# Altium project Xtern Ripper Boost-GaN.PrjPcb
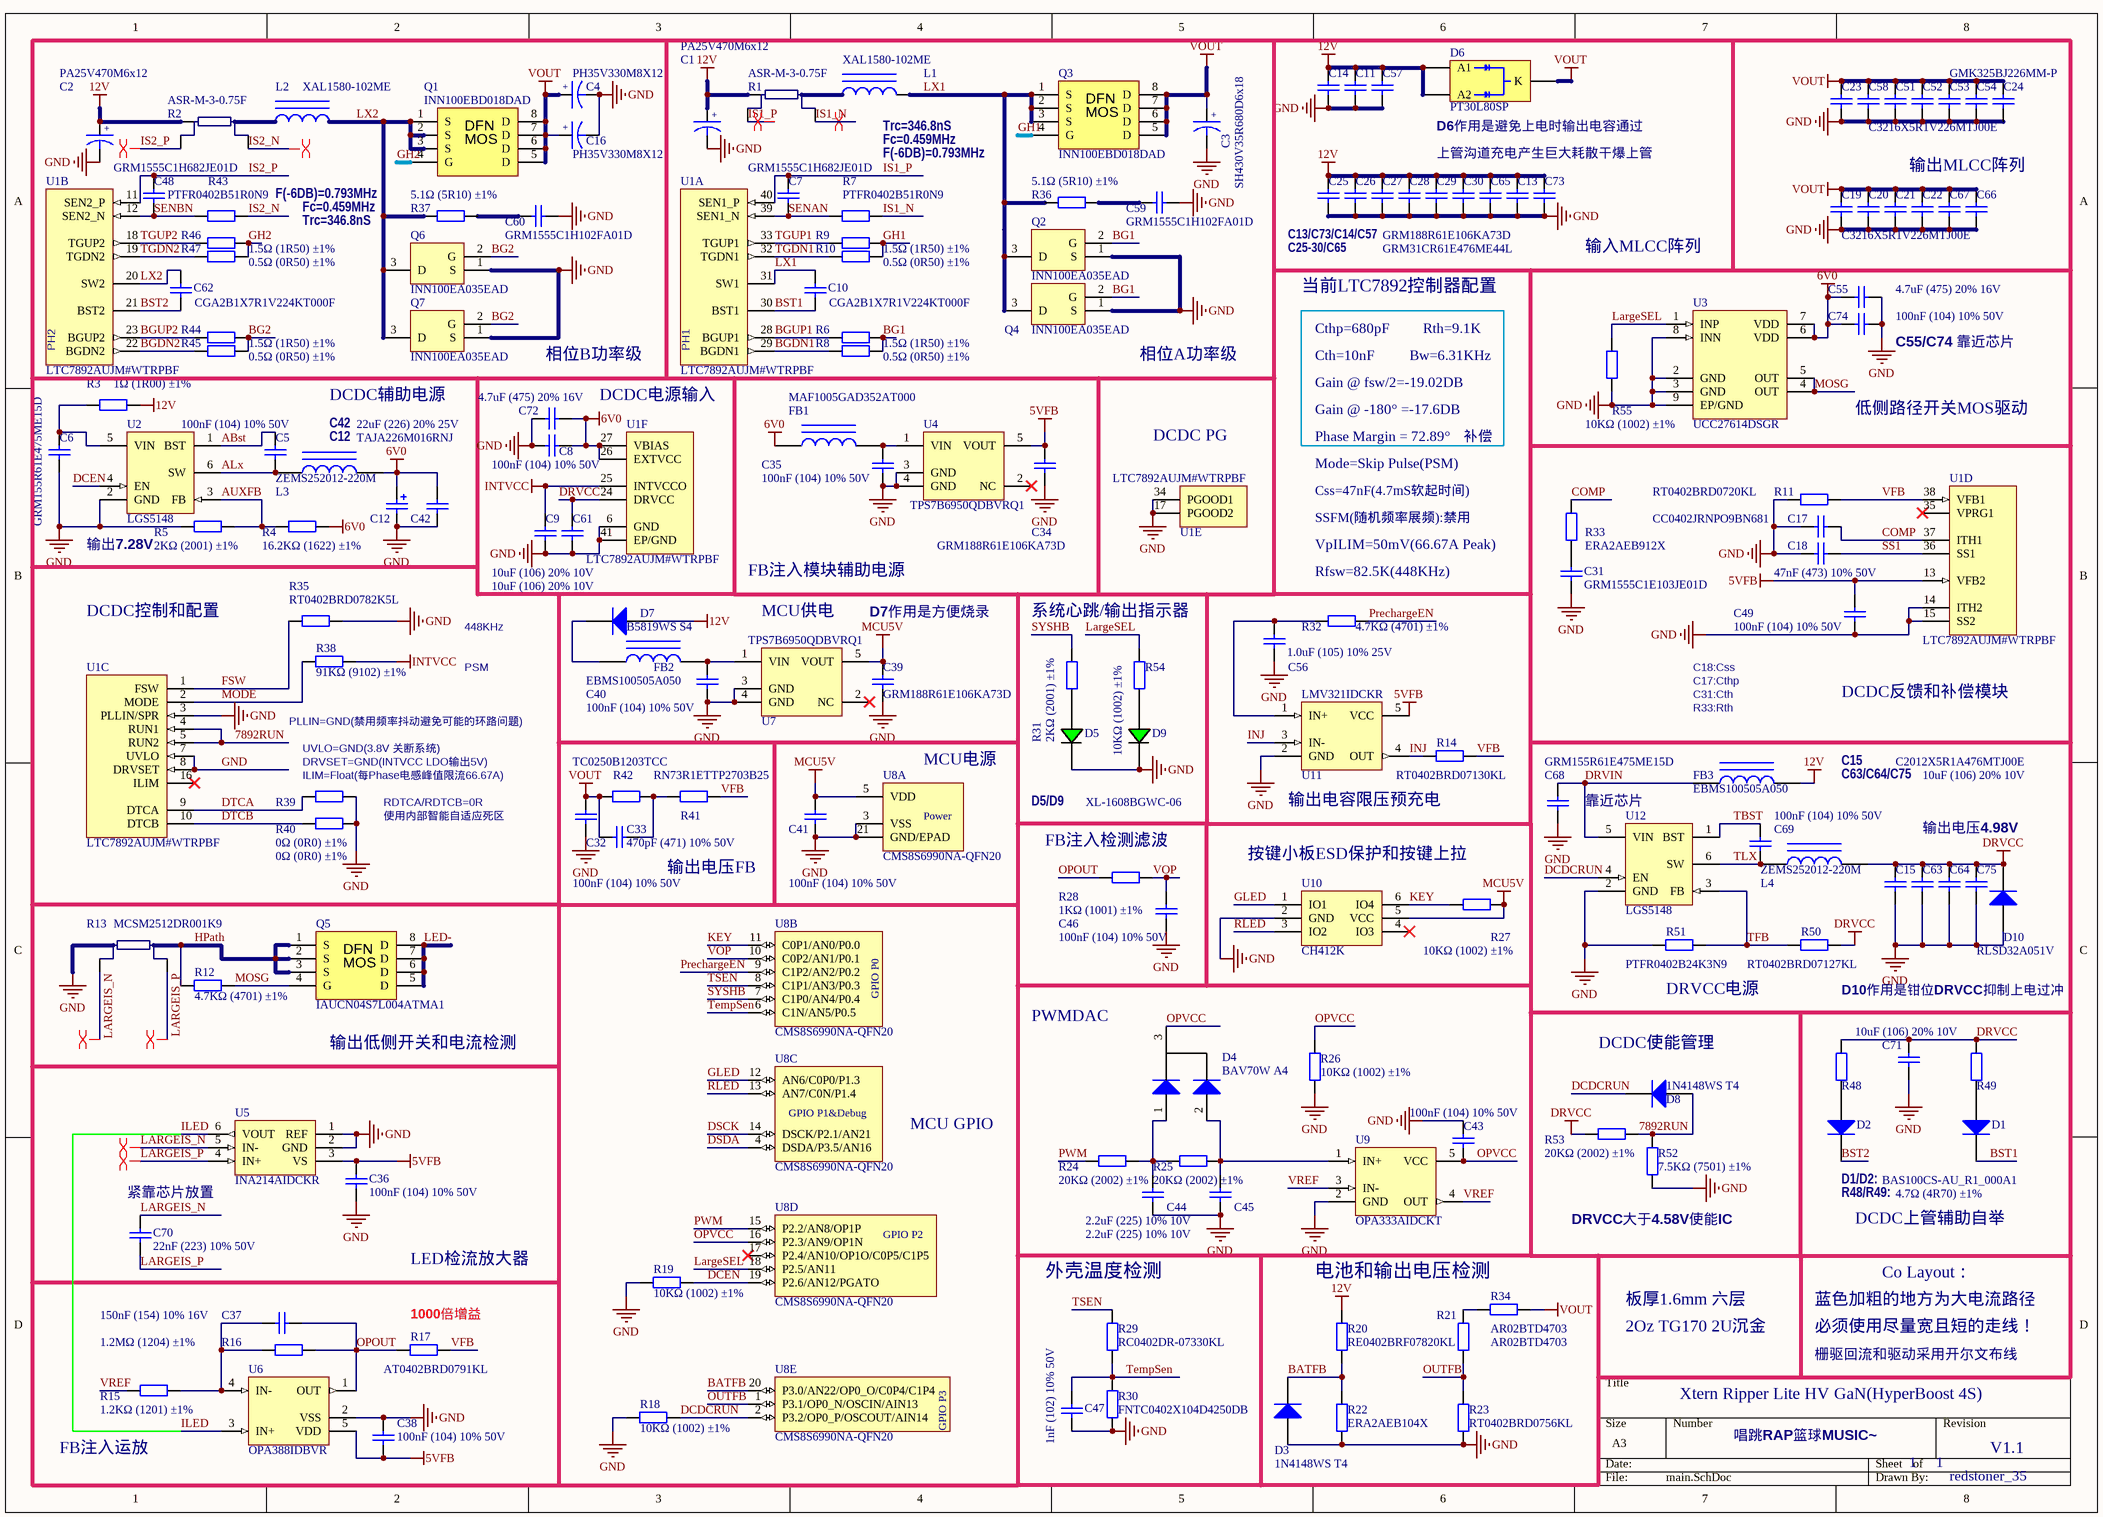
[diagram p0: main.SchDoc]
1 sheet, 165 parts. Net scope: global (net labels, ports and power ports of the same name join across sheets).
Board file: PCB2.PcbDoc

## Sheet main.SchDoc
size A3

### Parts
C1  PA25V470M6x12  [ElecCap_Hori]
C2  PA25V470M6x12  [ElecCap_Hori]
C3  SH430V35R680D6x18  [ElecCap_Hori]
C4  PH35V330M8X12  [CAP-8/3.5]
C5  100nF (104) 10% 50V  [0402_C]
C6  GRM155R61E475ME15D  [0402_C]
C7  GRM1555C1H682JE01D  [0402_C]
C8  100nF (104) 10% 50V  [0402_C]
C9  10uF (106) 20% 10V  [0402_C]
C10  CGA2B1X7R1V224KT000F  [0402_C]
C11  GRM188R61E106KA73D  [0603_C]  (value not drawn)
C12  TAJA226M016RNJ  [CASE-A_3216]
C13  GRM188R61E106KA73D  [0603_C]  (value not drawn)
C14  GRM188R61E106KA73D  [0603_C]
C15  C2012X5R1A476MTJ00E  [0805_C]
C16  PH35V330M8X12  [CAP-8/3.5]
C17  CC0402JRNPO9BN681  [0402_C]
C18  47nF (473) 10% 50V  [0402_C]
C19  C3216X5R1V226MTJ00E  [1206C]
C20  C3216X5R1V226MTJ00E  [1206C]  (value not drawn)
C21  C3216X5R1V226MTJ00E  [1206C]  (value not drawn)
C22  C3216X5R1V226MTJ00E  [1206C]  (value not drawn)
C23  C3216X5R1V226MTJ00E  [1206C]
C24  GMK325BJ226MM-P  [1210C]
C25  GRM31CR61E476ME44L  [1206C]
C26  GRM31CR61E476ME44L  [1206C]  (value not drawn)
C27  GRM31CR61E476ME44L  [1206C]  (value not drawn)
C28  GRM31CR61E476ME44L  [1206C]  (value not drawn)
C29  GRM31CR61E476ME44L  [1206C]  (value not drawn)
C30  GRM31CR61E476ME44L  [1206C]  (value not drawn)
C31  GRM1555C1E103JE01D  [0402_C]
C32  100nF (104) 10% 50V  [0402_C]
C33  470pF (471) 10% 50V  [0402_C]
C34  GRM188R61E106KA73D  [0603_C]
C35  100nF (104) 10% 50V  [0402_C]
C36  100nF (104) 10% 50V  [0402_C]
C37  150nF (154) 10% 16V  [0402_C]
C38  100nF (104) 10% 50V  [0402_C]
C39  GRM188R61E106KA73D  [0603_C]
C40  100nF (104) 10% 50V  [0402_C]
C41  100nF (104) 10% 50V  [0402_C]
C42  22uF (226) 20% 25V  [0805_C]
C43  100nF (104) 10% 50V  [0402_C]
C44  2.2uF (225) 10% 10V  [0402_C]
C45  2.2uF (225) 10% 10V  [0402_C]
C46  100nF (104) 10% 50V  [0402_C]
C47  1nF (102) 10% 50V  [0402_C]
C48  GRM1555C1H682JE01D  [0402_C]
C49  100nF (104) 10% 50V  [0402_C]
C51  C3216X5R1V226MTJ00E  [1206C]  (value not drawn)
C52  C3216X5R1V226MTJ00E  [1206C]  (value not drawn)
C53  C3216X5R1V226MTJ00E  [1206C]  (value not drawn)
C54  C3216X5R1V226MTJ00E  [1206C]  (value not drawn)
C55  4.7uF (475) 20% 16V  [0402_C]
C56  1.0uF (105) 10% 25V  [0402_C]
C57  GRM31CR61E476ME44L  [1206C]  (value not drawn)
C58  C3216X5R1V226MTJ00E  [1206C]  (value not drawn)
C59  GRM1555C1H102FA01D  [0402_C]
C60  GRM1555C1H102FA01D  [0402_C]
C61  10uF (106) 20% 10V  [0402_C]
C62  CGA2B1X7R1V224KT000F  [0402_C]
C63  10uF (106) 20% 10V  [0402_C]
C64  10uF (106) 20% 10V  [0402_C]  (value not drawn)
C65  GRM31CR61E476ME44L  [1206C]  (value not drawn)
C66  C3216X5R1V226MTJ00E  [1206C]  (value not drawn)
C67  C3216X5R1V226MTJ00E  [1206C]  (value not drawn)
C68  GRM155R61E475ME15D  [0402_C]
C69  100nF (104) 10% 50V  [0402_C]
C70  22nF (223) 10% 50V  [0402_C]
C71  10uF (106) 20% 10V  [0402_C]
C72  4.7uF (475) 20% 16V  [0402_C]
C73  GRM188R61E106KA73D  [0603_C]  (value not drawn)
C74  100nF (104) 10% 50V  [0402_C]
C75  10uF (106) 20% 10V  [0402_C]  (value not drawn)
D1  BAS100CS-AU_R1_000A1  [SOD-323]
D2  BAS100CS-AU_R1_000A1  [SOD-323]  (value not drawn)
D3  1N4148WS T4  [SOD-323]
D4  BAV70W A4  [SC70-3]
D5  XL-1608BGWC-06  [LED-0402]
D6  PT30L80SP  [TO277]
D7  B5819WS S4  [SOD-323]
D8  1N4148WS T4  [SOD-323]
D9  XL-1608BGWC-06  [LED-0402]  (value not drawn)
D10  RLSD32A051V  [SOD-323]
FB1  MAF1005GAD352AT000  [0402_L]
FB2  EBMS100505A050  [0402_L]
FB3  EBMS100505A050  [0402_L]
L1  XAL1580-102ME  [XAL1580_xxxME]
L2  XAL1580-102ME  [XAL1580_xxxME]
L3  ZEMS252012-220M  [SWPA252010S]
L4  ZEMS252012-220M  [SWPA252010S]
Q1  INN100EBD018DAD  [EN-FCLGA-8_L6.0-W5.0-P1.27-BL-EP]
Q2  INN100EA035EAD  [FCLGA-8_L3.3-W3.3_INN100EA070DAD]
Q3  INN100EBD018DAD  [EN-FCLGA-8_L6.0-W5.0-P1.27-BL-EP]
Q4  INN100EA035EAD  [FCLGA-8_L3.3-W3.3_INN100EA070DAD]
Q5  IAUCN04S7L004ATMA1  [SON/DFN5x6(MOS)]
Q6  INN100EA035EAD  [FCLGA-8_L3.3-W3.3_INN100EA070DAD]
Q7  INN100EA035EAD  [FCLGA-8_L3.3-W3.3_INN100EA070DAD]
R1  ASR-M-3-0.75F  [2512-Virtual4Wire]
R2  ASR-M-3-0.75F  [2512-Virtual4Wire]
R3  1Ω (1R00) ±1%  [0402_R]
R4  16.2KΩ (1622) ±1%  [0402_R]
R5  2KΩ (2001) ±1%  [0402_R]
R6  1.5Ω (1R50) ±1%  [0402_R]
R7  PTFR0402B51R0N9  [0402_R]
R8  0.5Ω (0R50) ±1%  [0402_R]
R9  1.5Ω (1R50) ±1%  [0402_R]
R10  0.5Ω (0R50) ±1%  [0402_R]
R11  RT0402BRD0720KL  [0402_R]
R12  4.7KΩ (4701) ±1%  [0402_R]
R13  MCSM2512DR001K9  [2512-Virtual4Wire]
R14  RT0402BRD07130KL  [0402_R]
R15  1.2KΩ (1201) ±1%  [0402_R]
R16  1.2MΩ (1204) ±1%  [0402_R]
R17  AT0402BRD0791KL  [0402_R]
R18  10KΩ (1002) ±1%  [0402_R]
R19  10KΩ (1002) ±1%  [0402_R]
R20  RE0402BRF07820KL  [0402_R]
R21  AR02BTD4703  [0402_R]
R22  ERA2AEB104X  [0402_R]
R23  RT0402BRD0756KL  [0402_R]
R24  20KΩ (2002) ±1%  [0402_R]
R25  20KΩ (2002) ±1%  [0402_R]
R26  10KΩ (1002) ±1%  [0402_R]
R27  10KΩ (1002) ±1%  [0402_R]
R28  1KΩ (1001) ±1%  [0402_R]
R29  RC0402DR-07330KL  [0402_R]
R30  FNTC0402X104D4250DB  [0402_R]
R31  2KΩ (2001) ±1%  [0402_R]
R32  4.7KΩ (4701) ±1%  [0402_R]
R33  ERA2AEB912X  [0402_R]
R34  AR02BTD4703  [0402_R]
R35  RT0402BRD0782K5L  [0402_R]
R36  5.1Ω (5R10) ±1%  [0603_R]
R37  5.1Ω (5R10) ±1%  [0603_R]
R38  91KΩ (9102) ±1%  [0402_R]
R39  0Ω (0R0) ±1%  [0402_R]
R40  0Ω (0R0) ±1%  [0402_R]
R41  RN73R1ETTP2703B25  [0402_R]
R42  TC0250B1203TCC  [0402_R]
R43  PTFR0402B51R0N9  [0402_R]
R44  1.5Ω (1R50) ±1%  [0402_R]
R45  0.5Ω (0R50) ±1%  [0402_R]
R46  1.5Ω (1R50) ±1%  [0402_R]
R47  0.5Ω (0R50) ±1%  [0402_R]
R48  4.7Ω (4R70) ±1%  [0402_R]
R49  4.7Ω (4R70) ±1%  [0402_R]  (value not drawn)
R50  RT0402BRD07127KL  [0402_R]
R51  PTFR0402B24K3N9  [0402_R]
R52  7.5KΩ (7501) ±1%  [0402_R]
R53  20KΩ (2002) ±1%  [0402_R]
R54  10KΩ (1002) ±1%  [0402_R]
R55  10KΩ (1002) ±1%  [0402_R]
U1  LTC7892AUJM#WTRPBF  [UJM0040A]  (parts A,B,C,D,E,F of 6)
U2  LGS5148  [SOT95P245X110-6N]
U3  UCC27614DSGR  [DSG0008A]
U4  TPS7B6950QDBVRQ1  [SOT95P245X110-5N]
U5  INA214AIDCKR  [SC70-6]
U6  OPA388IDBVR  [SOT95P245X110-5N]
U7  TPS7B6950QDBVRQ1  [SOT95P245X110-5N]
U8  CMS8S6990NA-QFN20  [QFN40P300X300X800_HS-21N]  (parts A,B,C,D,E of 5)
U9  OPA333AIDCKT  [SC70-5]
U10  CH412K  [SC70-6]
U11  LMV321IDCKR  [SC70-5]
U12  LGS5148  [SOT95P245X110-6N]

### Nets
5VFB: C34.2 C36.2 C38.1 C49.2 U1.13(VFB2) U4.5(VOUT) U5.3(VS) U6.5(VDD) U11.5(VCC)
6V0: C8.2 C12.1 C42.2 C55.1 C72.2 C74.1 FB1.1 L3.1 R4.1 U1.26(EXTVCC) U1.27(VBIAS) U3.6(VDD) U3.7(VDD)
12V: C1.1 C2.1 C11.2 C13.2 C14.2 C25.2 C26.2 C27.2 C28.2 C29.2 C30.2 C57.2 C65.2 C73.2 D6.2(A1) D6.3(A2) D7.1(A) FB3.2 R1.0(CIN) R2.1(CIN) R3.2 R20.2
DRVCC: C15.2 C61.2 C63.2 C64.2 C71.2 C75.2 D10.2(K) L4.1 R48.2 R49.1 R50.2 R53.1 U1.24(DRVCC)
GND: C1.2 C2.2 C3.2 C4.2 C6.1 C8.1 C9.1 C11.1 C12.2 C13.1 C14.1 C15.1 C16.2 C17.1 C18.1 C19.1 C20.1 C21.1 C22.1 C23.1 C24.1 C25.1 C26.1 C27.1 C28.1 C29.1 C30.1 C31.1 C32.1 C34.1 C35.1 C36.1 C38.2 C39.1 C40.1 C41.1 C42.1 C43.1 C44.1 C45.1 C46.1 C47.1 C49.1 C51.1 C52.1 C53.1 C54.1 C55.2 C56.1 C57.1 C58.1 C59.2 C60.2 C61.1 C63.1 C64.1 C65.1 C66.1 C67.1 C68.2 C71.1 C72.1 C73.1 C74.2 C75.1 D3.1(A) D5.K D9.K D10.1(A) Q2.1(S) Q4.1(S) Q6.1(S) Q7.1(S) R5.2 R11.1 R13.0(CIN) R18.2 R19.1 R22.1 R23.1 R26.1 R30.1 R35.2 R39.2 R40.2 R51.1 R52.1 R55.1 U1.3(PLLIN/SPR) U1.6(GND) U1.7(UVLO) U1.8(DRVSET) U1.14(ITH2) U1.15(SS2) U1.17(PGOOD2) U1.34(PGOOD1) U1.41(EP/GND) U2.2(GND) U3.2(GND) U3.3(GND) U3.8(INN) U3.9(EP/GND) U4.3(GND) U4.4(GND) U5.1(REF) U5.2(GND) U6.2(VSS) U7.3(GND) U7.4(GND) U8.3(VSS) U8.21(GND/EPAD) U9.2(GND) U10.2(GND) U11.2(GND) U12.2(GND)
INTVCC: C9.2 R38.2 U1.25(INTVCCO)
MCU5V: C39.2 C41.2 R27.2 U7.5(VOUT) U8.5(VDD) U10.5(VCC)
VOUT: C3.1 C4.1 C16.1 C19.2 C20.2 C21.2 C22.2 C23.2 C24.2 C32.2 C33.1 C51.2 C52.2 C53.2 C54.2 C58.2 C66.2 C67.2 D6.1(K) Q1.5(D) Q1.6(D) Q1.7(D) Q1.8(D) Q3.5(D) Q3.6(D) Q3.7(D) Q3.8(D) R34.2 R42.1
7892RUN: D8.1(A) R52.2 R53.2 U1.4(RUN1) U1.5(RUN2)
ABst: C5.2 U2.1(BST)
ALx: C5.1 L3.2 U2.6(SW)
AUXFB: R4.2 R5.1 U2.3(FB)
BATFB: D3.2(K) R20.1 R22.2 U8.20(P3.0/AN22/OP0_O/C0P4/C1P4)
BG1: Q2.2(G) Q4.2(G) R6.2 R8.2
BG2: Q6.2(G) Q7.2(G) R44.2 R45.2
BGDN1: R8.1 U1.29(BGDN1)
BGDN2: R45.1 U1.22(BGDN2)
BGUP1: R6.1 U1.28(BGUP1)
BGUP2: R44.1 U1.23(BGUP2)
BST1: C10.1 D1.2(K) U1.30(BST1)
BST2: C62.1 D2.2(K) U1.21(BST2)
COMP: C17.2 R33.2 U1.37(ITH1)
DCDCRUN: D8.2(K) R18.1 U8.2(P3.2/OP0_P/OSCOUT/AIN14) U12.4(EN)
DCEN: R19.2 U2.4(EN) U8.19(P2.6/AN12/PGATO)
DRVIN: C68.1 FB3.1 U12.5(VIN)
DSCK: U8.14(DSCK/P2.1/AN21)
DSDA: U8.4(DSDA/P3.5/AN16)
DTCA: R39.1 U1.9(DTCA)
DTCB: R40.1 U1.10(DTCB)
FSW: R35.1 U1.1(FSW)
GH1: Q3.4(G) R9.2 R10.2
GH2: Q1.4(G) R46.2 R47.2
GLED: U8.12(AN6/C0P0/P1.3) U10.1(IO1)
HPath: Q5.1(S) Q5.2(S) Q5.3(S) R12.2 R13.1(CIN)
ILED: U5.6(VOUT) U6.3(IN+)
INJ: R14.1 U11.3(IN-) U11.4(OUT)
IS1_N: R1.3(CIN) R7.2
IS1_P: C7.2 R1.2(CIN) U1.40(SEN1_P)
IS2_N: R2.2(CIN) R43.2
IS2_P: C48.2 R2.3(CIN) U1.11(SEN2_P)
KEY: R27.1 U8.11(C0P1/AN0/P0.0) U10.6(IO4)
LARGEIS_N: C70.2 R13.2(CIN) U5.5(IN-)
LARGEIS_P: C70.1 R13.3(CIN) U5.4(IN+)
LargeSEL: R54.2 R55.2 U3.1(INP) U8.18(P2.5/AN11)
LED-: Q5.5(D) Q5.6(D) Q5.7(D) Q5.8(D)
LX1: C10.2 L1.2 Q2.3(D) Q3.1(S) Q3.2(S) Q3.3(S) Q4.3(D) R36.1 U1.31(SW1)
LX2: C62.2 L2.2 Q1.1(S) Q1.2(S) Q1.3(S) Q6.3(D) Q7.3(D) R37.1 U1.20(SW2)
MODE: R38.1 U1.2(MODE)
MOSG: Q5.4(G) R12.1 U3.4(OUT) U3.5(OUT)
OPOUT: C37.2 R16.2 R17.1 R28.1 U6.1(OUT)
OPVCC: C43.2 D4.3(K) R26.2 U8.16(P2.3/AN9/OP1N) U9.5(VCC)
OUTFB: R21.1 R23.2 U8.1(P3.1/OP0_N/OSCIN/AIN13)
PrechargeEN: R32.2 U8.9(C1P2/AN2/P0.2)
PWM: R24.1 U8.15(P2.2/AN8/OP1P)
RLED: U8.13(AN7/C0N/P1.4) U10.3(IO2)
SENAN: C7.1 R7.1 U1.39(SEN1_N)
SENBN: C48.1 R43.1 U1.12(SEN2_N)
SS1: C18.2 U1.36(SS1)
SYSHB: R31.2 U8.7(C1P0/AN4/P0.4)
TBST: C69.2 U12.1(BST)
TempSen: C47.2 R29.1 R30.2 U8.6(C1N/AN5/P0.5)
TFB: R50.1 R51.2 U12.3(FB)
TGDN1: R10.1 U1.32(TGDN1)
TGDN2: R47.1 U1.19(TGDN2)
TGUP1: R9.1 U1.33(TGUP1)
TGUP2: R46.1 U1.18(TGUP2)
TLX: C69.1 L4.2 U12.6(SW)
TSEN: R29.2 U8.8(C1P1/AN3/P0.3)
VFB: R11.2 R14.2 R17.2 R41.2 U1.38(VFB1)
VOP: C46.2 R28.2 U8.10(C0P2/AN1/P0.1)
VREF: R15.1 U9.3(IN-) U9.4(OUT)
NetC6_2: C6.2 R3.1 U2.5(VIN)
NetC31_2: C31.2 R33.1
NetC33_2: C33.2 R41.1 R42.2
NetC35_2: C35.2 FB1.2 U4.1(VIN)
NetC37_1: C37.1 R15.2 R16.1 U6.4(IN-)
NetC40_2: C40.2 FB2.2 U7.1(VIN)
NetC44_2: C44.2 D4.1(A) R24.2 R25.1
NetC45_2: C45.2 D4.2(A) R25.2 U9.1(IN+)
NetC56_2: C56.2 R32.1 U11.1(IN+)
NetC59_1: C59.1 R36.2
NetC60_1: C60.1 R37.2
NetD1_1: D1.1(A) R49.2
NetD2_1: D2.1(A) R48.1
NetD5_A: D5.A R31.1
NetD7_2: D7.2(K) FB2.1
NetD9_A: D9.A R54.1
NetL1_1: L1.1 R1.1(CIN)
NetL2_1: L2.1 R2.0(CIN)
NetR21_2: R21.2 R34.1

Not connected (* = marked no-connect by the designer): U1 16(ILIM)* 35(VPRG1)*; U4 2(NC)*; U7 2(NC)*; U8 17(P2.4/AN10/OP1O/C0P5/C1P5)*; U10 4(IO3)*

### Layout directives
differential pair: IS1_N, IS1_P, IS2_N, IS2_P, LARGEIS_N, LARGEIS_P

### Notes on the sheet
- (near L1) Trc=346.8nS
- (near L1) Fc=0.459MHz
- F(-6DB)=0.793MHz
- (near D6) D6作用是避免上电时输出电容通过
- 上管沟道充电产生巨大耗散干爆上管
- 输出MLCC阵列
- Trc=346.8nS
- Fc=0.459MHz
- C25-30/C65
- C13/C73/C14/C57
- 输入MLCC阵列
- 当前LTC7892控制器配置
- 相位B功率级
- 相位A功率级
- Cthp=680pF
- Cth=10nF
- Gain @ fsw/2=-19.02DB
- Bw=6.31KHz
- Rth=9.1K
- C55/C74 靠近芯片
- DCDC辅助电源
- (near L3) C12
- C42
- DCDC电源输入
- DCDC PG
- Gain @ -180° =-17.6DB
- Phase Margin = 72.89°
- 补偿
- 低侧路径开关MOS驱动
- Mode=Skip Pulse(PSM)
- Css=47nF(4.7mS软起时间)
- SSFM(随机频率展频):禁用
- 输出7.28V
- FB注入模块辅助电源
- (near R32) Rfsw=82.5K(448KHz)
- VpILIM=50mV(66.67A Peak)
- DCDC控制和配置
- 448KHz
- (near U7) MCU供电
- D7作用是方便烧录
- 系统心跳/输出指示器
- PLLIN=GND(禁用频率抖动避免可能的环路问题)
- PSM
- C17:Cthp
- C31:Cth
- R33:Rth
- C18:Css
- DCDC反馈和补偿模块
- (near R39) UVLO=GND(3.8V 关断系统)
- (near R39) DRVSET=GND(INTVCC LDO输出5V)
- (near R39) ILIM=Float(每Phase电感峰值限流66.67A)
- MCU电源
- C15
- C63/C64/C75
- RDTCA/RDTCB=0R
- 使用内部智能自适应死区
- D5/D9
- (near R28) FB注入检测滤波
- (near U10) 按键小板ESD保护和按键上拉
- (near U11) 输出电容限压预充电
- 靠近芯片
- 输出电压4.98V
- 输出电压FB
- (near R51) DRVCC电源
- D10作用是钳位DRVCC抑制上电过冲
- (near Q5) 输出低侧开关和电流检测
- PWMDAC
- (near D8) DCDC使能管理
- MCU GPIO
- (near C70) 紧靠芯片放置
- (near D2) D1/D2:
- (near D2) R48/R49:
- LED检流放大器
- (near R52) DRVCC大于4.58V使能IC
- DCDC上管辅助自举
- (near R17) 1000倍增益
- (near R29) 外壳温度检测
- 电池和输出电压检测
- 板厚1.6mm 六层
- 2Oz TG170 2U沉金
- 蓝色加粗的地方为大电流路径
- 必须使用尽量宽且短的走线！
- Co Layout：
- Xtern Ripper Lite HV GaN(HyperBoost 4S)
- 栅驱回流和驱动采用开尔文布线
- FB注入运放
- 唱跳RAP篮球MUSIC~
- 1
- V1.1
- redstoner_35
- (in symbol CAP2) +
- (in symbol CM8S6990NA-QFN20, part A) Power
- (in symbol CM8S6990NA-QFN20, part B) GPIO P0
- (in symbol CM8S6990NA-QFN20, part C) GPIO P1&Debug
- (in symbol CM8S6990NA-QFN20, part D) GPIO P2
- (in symbol CM8S6990NA-QFN20, part E) GPIO P3
- (in symbol LTC7892RUJM, part A) PH1
- (in symbol LTC7892RUJM, part B) PH2

### Library data of the parts
C1 C2 = CAP2: 直插固态电容，耐压25V容量470uF，尺寸D6.3x12
C3 = CAP2: 升阳电子 直插特殊尺寸固态电容 680uF ±20% 35V 直径63mm长度18mm 2000Hr@105℃
C4 C16 = CAP2: 125°C 5000Hrs 高温耐受直插固态电容。耐压35V容量330uF，尺寸D8mmxL12mm
C5 C8 C18 C32 C35-C38 C40 C41 C43 C46 C49 C69 C74 = 0402 100nF (104) 10% 16V: 贴片电容; ComponentLink1Description: 供应商链接; ComponentLink1URL: http://www.szlcsc.com/product/details_1877.html; Package: 0402; Supplier: LC; SuppliersPartNumber: C1525
C6 C68 = 0402 1.0uF (105) 10% 25V: 0402贴片MLCC电容 4.7uF±20% 25V X5R; ComponentLink1Description: 供应商链接; ComponentLink1URL: http://www.szlcsc.com/product/details_53938.html; Package: 0402; Supplier: LC; SuppliersPartNumber: C52923
C7 C48 = 0402 1nF (102) 10% 50V: 0402贴片MLCC电容 6.8nF±5% 50V C0G/NP0; ComponentLink1Description: 供应商链接; ComponentLink1URL: http://www.szlcsc.com/product/details_1875.html; Package: 0402; Supplier: LC; SuppliersPartNumber: C1523
C9 C61 C71 = 0402 10uF (106) 20% 6.3V: 贴片电容; ComponentLink1Description: 供应商链接; ComponentLink1URL: http://www.szlcsc.com/product/details_16204.html; Package: 0402; Supplier: LC; SuppliersPartNumber: C15525
C10 C62 = 0402 220nF (224) 10% 16V: 车规级 0402贴片MLCC电容 35V 220nF±10% X7R; ComponentLink1Description: 供应商链接; ComponentLink1URL: http://www.szlcsc.com/product/details_17456.html; Package: 0402; Supplier: LC; SuppliersPartNumber: C16772
C11 C13 C14 C34 C39 C73 = 0603 10uF (106) 10% 10V: 贴片MLCC电容 25V 10uF±20% X5R; ComponentLink1Description: 供应商链接; ComponentLink1URL: http://www.szlcsc.com/product/details_20411.html; Package: 0603; Supplier: LC; SuppliersPartNumber: C19702
C12 = 3216 10uF (106) 10% 16V: 1206钽电容，22uF (226) ±10% 16V; ComponentLink1Description: 供应商链接; ComponentLink1URL: http://www.szlcsc.com/product/details_7643.html; Package: 3216; Supplier: LC; SuppliersPartNumber: C7171
C15 = 0805 22uF (226) 20% 25V: 贴片MLCC电容，X5R 47uF ±20% 10V; ComponentLink1Description: 供应商链接; ComponentLink1URL: http://www.szlcsc.com/product/details_46786.html; Package: 0805; Supplier: LC; SuppliersPartNumber: C45783
C17 = 0402 1nF (102) 10% 50V: 0402贴片MLCC电容 NP0材质 680pF ±5% 50V; ComponentLink1Description: 供应商链接; ComponentLink1URL: http://www.szlcsc.com/product/details_1875.html; Package: 0402; Supplier: LC; SuppliersPartNumber: C1523
C19-C23 C51-C54 C58 C66 C67 = Cap: TDK MLCC电容 X5R 35V 22uF±20%; Value: 22uF; Published: 8-Jun-2000; LatestRevisionDate: 17-Jul-2002; LatestRevisionNote: Re-released for DXP Platform.; PackageReference: RAD-0.3; Publisher: Altium Limited; PackageDescription: Radial Cap, Thru-Hole; 2 Leads; 0.3 in Pin Spacing
C24 = Cap: 1210 MLCC电容 35V 22uF ±20% X5R; Published: 8-Jun-2000; LatestRevisionDate: 17-Jul-2002; LatestRevisionNote: Re-released for DXP Platform.; PackageReference: RAD-0.3; Publisher: Altium Limited; PackageDescription: Radial Cap, Thru-Hole; 2 Leads; 0.3 in Pin Spacing; Value: 22uF
C25-C30 C57 C65 = Cap: 1206尺寸村田MLCC 25V 47uF X5R ±20%; Value: 22uF; Published: 8-Jun-2000; LatestRevisionDate: 17-Jul-2002; LatestRevisionNote: Re-released for DXP Platform.; PackageReference: RAD-0.3; Publisher: Altium Limited; PackageDescription: Radial Cap, Thru-Hole; 2 Leads; 0.3 in Pin Spacing
C31 = 0402 6.8nF (682) 10% 50V: 0402贴片MLCC电容 10nF±5% 25V C0G/NP0; ComponentLink1Description: 供应商链接; ComponentLink1URL: http://www.szlcsc.com/product/details_1894.html; Package: 0402; Supplier: LC; SuppliersPartNumber: C1542
C33 = 0402 470pF (471) 10% 50V: 贴片电容; ComponentLink1Description: 供应商链接; ComponentLink1URL: http://www.szlcsc.com/product/details_1889.html; Package: 0402; Supplier: LC; SuppliersPartNumber: C1537
C42 = 0805 22uF (226) 20% 25V: 贴片电容; ComponentLink1Description: 供应商链接; ComponentLink1URL: http://www.szlcsc.com/product/details_46786.html; Package: 0805; Supplier: LC; SuppliersPartNumber: C45783
C44 C45 C55 C56 C72 = 0402 1.0uF (105) 10% 25V: 贴片电容; ComponentLink1Description: 供应商链接; ComponentLink1URL: http://www.szlcsc.com/product/details_53938.html; Package: 0402; Supplier: LC; SuppliersPartNumber: C52923
C47 = 0402 1nF (102) 10% 50V: 贴片电容; ComponentLink1Description: 供应商链接; ComponentLink1URL: http://www.szlcsc.com/product/details_1875.html; Package: 0402; Supplier: LC; SuppliersPartNumber: C1523
C59 C60 = 0402 1nF (102) 10% 50V: 村田0402贴片MLCC电容 1nF ±1% 50V C0G; ComponentLink1Description: 供应商链接; ComponentLink1URL: http://www.szlcsc.com/product/details_1875.html; Package: 0402; Supplier: LC; SuppliersPartNumber: C1523
C63 C64 C75 = 0402 4.7uF (475) 20% 10V: 贴片电容; ComponentLink1Description: 供应商链接; ComponentLink1URL: http://www.szlcsc.com/product/details_24469.html; Package: 0402; Supplier: LC; SuppliersPartNumber: C23733
C70 = 0402 10nF (103) 10% 50V: 贴片电容; ComponentLink1Description: 供应商链接; ComponentLink1URL: http://www.szlcsc.com/product/details_15869.html; Package: 0402; Supplier: LC; SuppliersPartNumber: C15195
D1-D3 D7 D8 = SOD-323 1N4148WS T4: 二极管; ComponentLink1Description: 供应商链接; ComponentLink1URL: http://www.szlcsc.com/product/details_2485.html; Package: SOD-323; Supplier: LC; SuppliersPartNumber: C2128
D4 = SOT-23 BAV70 A4: 开关二极管; ComponentLink1Description: 供应商链接; ComponentLink1URL: http://www.szlcsc.com/product/details_70091.html; Package: SOT-23; Supplier: LC; SuppliersPartNumber: C68978
D5 D9 = LED0402: 0603(1608)贴片冰蓝色发光二极管 2.7-3.4V 20mA; Color: 冰蓝色
D6 = SB2045L: 30A 80V 肖特基二极管
D10 = SOD-323 1N4148WS T4: 单向TVS二极管 5V工作电压 峰值脉冲电流：21A@8/20us; ComponentLink1Description: 供应商链接; ComponentLink1URL: http://www.szlcsc.com/product/details_2485.html; Package: SOD-323; Supplier: LC; SuppliersPartNumber: C2128
FB1 = 0402 12nH  5%: 贴片铁氧体磁珠 270mA 500R@100MHz; ComponentLink1Description: 供应商链接; ComponentLink1URL: http://www.szlcsc.com/product/details_25303.html; Package: 0402; Supplier: LC; SuppliersPartNumber: C24563
FB2 FB3 = 0402 12nH  5%: 贴片磁珠 200mA 5R±25% 100MHz; ComponentLink1Description: 供应商链接; ComponentLink1URL: http://www.szlcsc.com/product/details_25303.html; Package: 0402; Supplier: LC; SuppliersPartNumber: C24563
L1 L2 = Inductor Iron: 线艺XAL系列电感; Value: 1.8uH; Published: 24-Mar-1999; LatestRevisionDate: 17-Jul-2002; LatestRevisionNote: Re-released for DXP Platform.; PackageReference: AXIAL-0.9; Publisher: Altium Limited; PackageDescription: Axial Device, Thru-Hole; 2 Leads; 0.9 in Pin Spacing
L3 L4 = Inductor Iron: 一体成型TCORE热压功率电感 2.5x2.0mm尺寸 1.0mm高度 22uH 0.78Ω 1.2A; Value: 4.7uH; Published: 24-Mar-1999; LatestRevisionDate: 17-Jul-2002; LatestRevisionNote: Re-released for DXP Platform.; PackageReference: AXIAL-0.9; Publisher: Altium Limited; PackageDescription: Axial Device, Thru-Hole; 2 Leads; 0.9 in Pin Spacing
Q1 Q3 = SON/DFN5x6 MOS: 基于先进GaN技术的100V硅基氮化镓增强型HEMT晶体管，采用En-FCLGA 5mm x 6mm 封装。
Q2 Q4 Q6 Q7 = INN100EA035A-C: 100V Enhancement-mode GaN Power Transistor, 2.7mΩ Gen3.5
Q5 = SON/DFN5x6 MOS: 0.44mΩ 40V 逻辑电平 OptiMOS 7 车规级MOSFET
R1 R2 = shunt: 业展ASR系列精密检流电阻，2512 0.75mΩ±1% 锰铜材质 <50ppm/K P70℃=5W
R3 R6 R8-R10 R44-R49 = 0402 1Ω (1R00) 1%: 贴片电阻; ComponentLink1Description: 供应商链接; ComponentLink1URL: http://www.szlcsc.com/product/details_25829.html; Package: 0402; Supplier: LC; SuppliersPartNumber: C25086
R4 R5 R12 R18 R19 R24 R26 R27 R54 R55 = 0402 10KΩ (1002) 1%: 贴片电阻; ComponentLink1Description: 供应商链接; ComponentLink1URL: http://www.szlcsc.com/product/details_26487.html; Package: 0402; Supplier: LC; SuppliersPartNumber: C25744
R7 R43 = 0402 10Ω (10R0) 1%: 0402高精密低温飘薄膜贴片电阻 51Ω ±0.1% 62.5mW 25PPM; ComponentLink1Description: 供应商链接; ComponentLink1URL: http://www.szlcsc.com/product/details_25820.html; Package: 0402; Supplier: LC; SuppliersPartNumber: C25077
R11 = 0402 20KΩ (2002) 1%: 0402贴片薄膜高精密电阻 20KΩ ±0.1% 62.5mW 25PPM; ComponentLink1Description: 供应商链接; ComponentLink1URL: http://www.szlcsc.com/product/details_26508.html; Package: 0402; Supplier: LC; SuppliersPartNumber: C25765
R13 = shunt: 精密低温漂束焊模压合金检流电阻 车规级别 1.0mΩ ±0.5% 3W
R14 = 0402 100KΩ (1003) 1%: 0402贴片薄膜高精密电阻 130KΩ ±0.1% 62.5mW 25PPM; ComponentLink1Description: 供应商链接; ComponentLink1URL: http://www.szlcsc.com/product/details_26484.html; Package: 0402; Supplier: LC; SuppliersPartNumber: C25741
R15 = 0402 470Ω (4700) 1%: 贴片电阻; ComponentLink1Description: 供应商链接; ComponentLink1URL: http://www.szlcsc.com/product/details_25860.html; Package: 0402; Supplier: LC; SuppliersPartNumber: C25117
R16 = 0402 1MΩ (1004) 1%: 贴片电阻; ComponentLink1Description: 供应商链接; ComponentLink1URL: http://www.szlcsc.com/product/details_26826.html; Package: 0402; Supplier: LC; SuppliersPartNumber: C26083
R17 = 0402 100KΩ (1003) 1%: 0402贴片薄膜高精密电阻 91KΩ ±0.1% 62.5mW 25PPM; ComponentLink1Description: 供应商链接; ComponentLink1URL: http://www.szlcsc.com/product/details_26484.html; Package: 0402; Supplier: LC; SuppliersPartNumber: C25741
R20 = 0402 680Ω (6800) 1%: 0402精密低温飘贴片电阻 820K±0.1% 62.5mW; ComponentLink1Description: 供应商链接; ComponentLink1URL: http://www.szlcsc.com/product/details_25873.html; Package: 0402; Supplier: LC; SuppliersPartNumber: C25130
R21 = 0402 470KΩ (4703) 1%: 0402 贴片薄膜高精密低温飘电阻 470KΩ±0.1% 25PPM; ComponentLink1Description: 供应商链接; ComponentLink1URL: http://www.szlcsc.com/product/details_26533.html; Package: 0402; Supplier: LC; SuppliersPartNumber: C25790
R22 = 0402 100KΩ (1003) 1%: 松下 0402精密低温飘贴片电阻 100±0.1% 62.5mW; ComponentLink1Description: 供应商链接; ComponentLink1URL: http://www.szlcsc.com/product/details_26484.html; Package: 0402; Supplier: LC; SuppliersPartNumber: C25741
R23 = 0402 100KΩ (1003) 1%: 0402薄膜贴片高精密电阻 56K±0.1% 62.5mW; ComponentLink1Description: 供应商链接; ComponentLink1URL: http://www.szlcsc.com/product/details_26484.html; Package: 0402; Supplier: LC; SuppliersPartNumber: C25741
R25 R32 R53 = 0402 20KΩ (2002) 1%: 贴片电阻; ComponentLink1Description: 供应商链接; ComponentLink1URL: http://www.szlcsc.com/product/details_26508.html; Package: 0402; Supplier: LC; SuppliersPartNumber: C25765
R28 = 0402 1KΩ (1001) 1%: 贴片电阻; ComponentLink1Description: 供应商链接; ComponentLink1URL: http://www.szlcsc.com/product/details_12256.html; Package: 0402; Supplier: LC; SuppliersPartNumber: C11702
R29 = 0402 330KΩ (3303) 1%: 0402厚膜较高精度贴片电阻 330KΩ±0.5% 62.5mW; ComponentLink1Description: 供应商链接; ComponentLink1URL: http://www.szlcsc.com/product/details_26521.html; Package: 0402; Supplier: LC; SuppliersPartNumber: C25778
R30 = 0402 100KΩ (1003) 1%: 0402尺寸贴片式NTC热敏电阻 B25-85℃=4310±0.5% R25=100KΩ±0.5%; ComponentLink1Description: 供应商链接; ComponentLink1URL: http://www.szlcsc.com/product/details_26484.html; Package: 0402; Supplier: LC; SuppliersPartNumber: C25741
R31 = 0402 2KΩ (2001) 1%: 贴片电阻; ComponentLink1Description: 供应商链接; ComponentLink1URL: http://www.szlcsc.com/product/details_4516.html; Package: 0402; Supplier: LC; SuppliersPartNumber: C4109
R33 = 0402 10KΩ (1002) 1%: 松下高精密0402贴片薄膜电阻 9.1KΩ ±0.1% 62.5mW 5PPM; ComponentLink1Description: 供应商链接; ComponentLink1URL: http://www.szlcsc.com/product/details_26487.html; Package: 0402; Supplier: LC; SuppliersPartNumber: C25744
R34 = 0402 10KΩ (1002) 1%: 0402 贴片薄膜高精密低温飘电阻 470KΩ±0.1% 25PPM; ComponentLink1Description: 供应商链接; ComponentLink1URL: http://www.szlcsc.com/product/details_26487.html; Package: 0402; Supplier: LC; SuppliersPartNumber: C25744
R35 = 0402 100KΩ (1003) 1%: 薄膜低温飘高精密电阻 82.5KΩ (8242) ± 0.1% 25PPM; ComponentLink1Description: 供应商链接; ComponentLink1URL: http://www.szlcsc.com/product/details_26484.html; Package: 0402; Supplier: LC; SuppliersPartNumber: C25741
R36 R37 = 0603 2.2Ω (2R20) 1%: 贴片电阻; ComponentLink1Description: 供应商链接; ComponentLink1URL: http://www.szlcsc.com/product/details_23666.html; Package: 0603; Supplier: LC; SuppliersPartNumber: C22939
R38 = 0402 100KΩ (1003) 1%: 贴片电阻; ComponentLink1Description: 供应商链接; ComponentLink1URL: http://www.szlcsc.com/product/details_26484.html; Package: 0402; Supplier: LC; SuppliersPartNumber: C25741
R39 R40 = 0402 0Ω (0R0) 1%: 贴片电阻; ComponentLink1Description: 供应商链接; ComponentLink1URL: http://www.szlcsc.com/product/details_17853.html; Package: 0402; Supplier: LC; SuppliersPartNumber: C17168
R41 = 0402 200KΩ (2003) 1%: KOA RN73系列0402贴片薄膜高精密电阻 270KΩ±0.1% 62.5mW ±25PPM; ComponentLink1Description: 供应商链接; ComponentLink1URL: http://www.szlcsc.com/product/details_26507.html; Package: 0402; Supplier: LC; SuppliersPartNumber: C25764
R42 = 0402 120KΩ (1203) 1%: 镍铬薄膜高精密0402贴片电阻 120KΩ ±0.1% 25PPM; ComponentLink1Description: 供应商链接; ComponentLink1URL: http://www.szlcsc.com/product/details_26493.html; Package: 0402; Supplier: LC; SuppliersPartNumber: C25750
R50 = 0402 27KΩ (2702) 1%: 精密高稳定性0402贴片电阻 127KΩ ±0.1% 25PPM; ComponentLink1Description: 供应商链接; ComponentLink1URL: http://www.szlcsc.com/product/details_26514.html; Package: 0402; Supplier: LC; SuppliersPartNumber: C25771
R51 = 0402 4.7KΩ (4701) 1%: 高精密高稳定性0402贴片电阻 24.3KΩ ±0.1% 5PPM; ComponentLink1Description: 供应商链接; ComponentLink1URL: http://www.szlcsc.com/product/details_26643.html; Package: 0402; Supplier: LC; SuppliersPartNumber: C25900
R52 = 0402 8.2KΩ (8201) 1%: 贴片电阻; ComponentLink1Description: 供应商链接; ComponentLink1URL: http://www.szlcsc.com/product/details_26667.html; Package: 0402; Supplier: LC; SuppliersPartNumber: C25924
U1 = LTC7892RUJM: Low IQ  , Dual, 2-Phase Synchronous Boost Controller for GaN FETs, AEC-Q100 Certified
U2 U12 = LGS5148: 48V输入，600mA同步降压转换器，SOT-23-6封装
U3 = UCC27614DSGR: 10A峰值电流驱动能力的单路低侧栅极驱动器，17.5nS典型传播延迟，WSON8封装
U4 U7 = TPS7B6933DBVR: 150mA 40V max input Ultra low Iq LDO,fixed   5V output AECQ100 Qualified
U5 = INA199A2DCKR: 100V/V增益 26V最高共模电压，高低测通用双向高精度检流放大器 SC70-6封装
U6 = TLV333IDBVR: 单路、10MHz、CMOS、零温漂、零交叉、真 RRIO 精密运算放大器
U8 = CM8S6990NA-QFN20: 增强型闪存1T 8051单片机，16KB Flash 256+1K XRAM
U9 = LMV321IDCKR: 微功耗、1.8V、17uA 零漂移 CMOS 精密运算放大器
U10 = CH412K: very low capacity quad IO ESD protection Array
U11 = LMV321IDCKR: CMOS超小型运算放大器，SC70-5